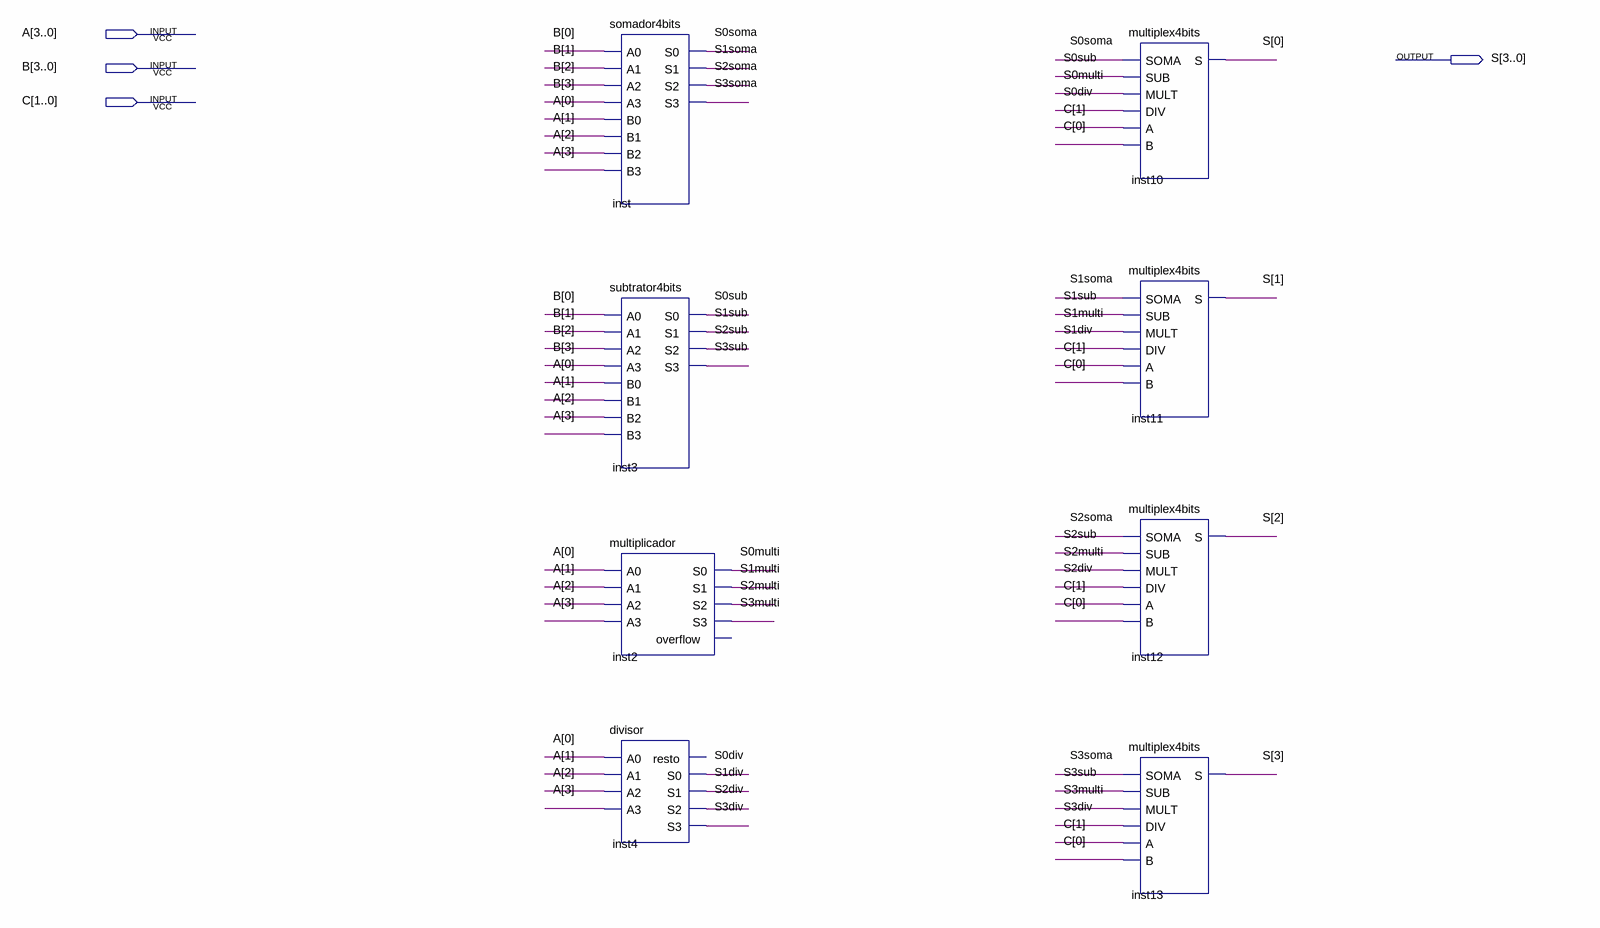
[diagram p0: schematic sheet]
// Quartus schematic ULA.bdf as structural Verilog: 8 symbols, 4 pins
module ULA (
  input  [3:0] A,
  input  [3:0] B,
  input  [1:0] C,
  output [3:0] S
);

  wire S0div, S0multi, S0soma, S0sub, S1div, S1multi, S1soma, S1sub, S2div, S2multi, S2soma, S2sub, S3div,
       S3multi, S3soma, S3sub;

  somador4bits inst (
    .A0(B[0]), .A1(B[1]), .A2(B[2]), .A3(B[3]), .B0(A[0]), .B1(A[1]), .B2(A[2]), .B3(A[3]), .S0(S0soma),
    .S1(S1soma), .S2(S2soma), .S3(S3soma));
  subtrator4bits inst3 (
    .A0(B[0]), .A1(B[1]), .A2(B[2]), .A3(B[3]), .B0(A[0]), .B1(A[1]), .B2(A[2]), .B3(A[3]), .S0(S0sub),
    .S1(S1sub), .S2(S2sub), .S3(S3sub));
  multiplicador inst2 (
    .A0(A[0]), .A1(A[1]), .A2(A[2]), .A3(A[3]), .S0(S0multi), .S1(S1multi), .S2(S2multi), .S3(S3multi));  // open: overflow
  divisor inst4 (
    .A0(A[0]), .A1(A[1]), .A2(A[2]), .A3(A[3]), .S0(S0div), .S1(S1div), .S2(S2div), .S3(S3div));  // open: resto
  multiplex4bits inst10 (.SOMA(S0soma), .SUB(S0sub), .MULT(S0multi), .DIV(S0div), .A(C[1]), .B(C[0]), .S(S[0]));
  multiplex4bits inst11 (.SOMA(S1soma), .SUB(S1sub), .MULT(S1multi), .DIV(S1div), .A(C[1]), .B(C[0]), .S(S[1]));
  multiplex4bits inst12 (.SOMA(S2soma), .SUB(S2sub), .MULT(S2multi), .DIV(S2div), .A(C[1]), .B(C[0]), .S(S[2]));
  multiplex4bits inst13 (.SOMA(S3soma), .SUB(S3sub), .MULT(S3multi), .DIV(S3div), .A(C[1]), .B(C[0]), .S(S[3]));
endmodule
